# EAGLE design EspLight (EAGLE 7.4.0)
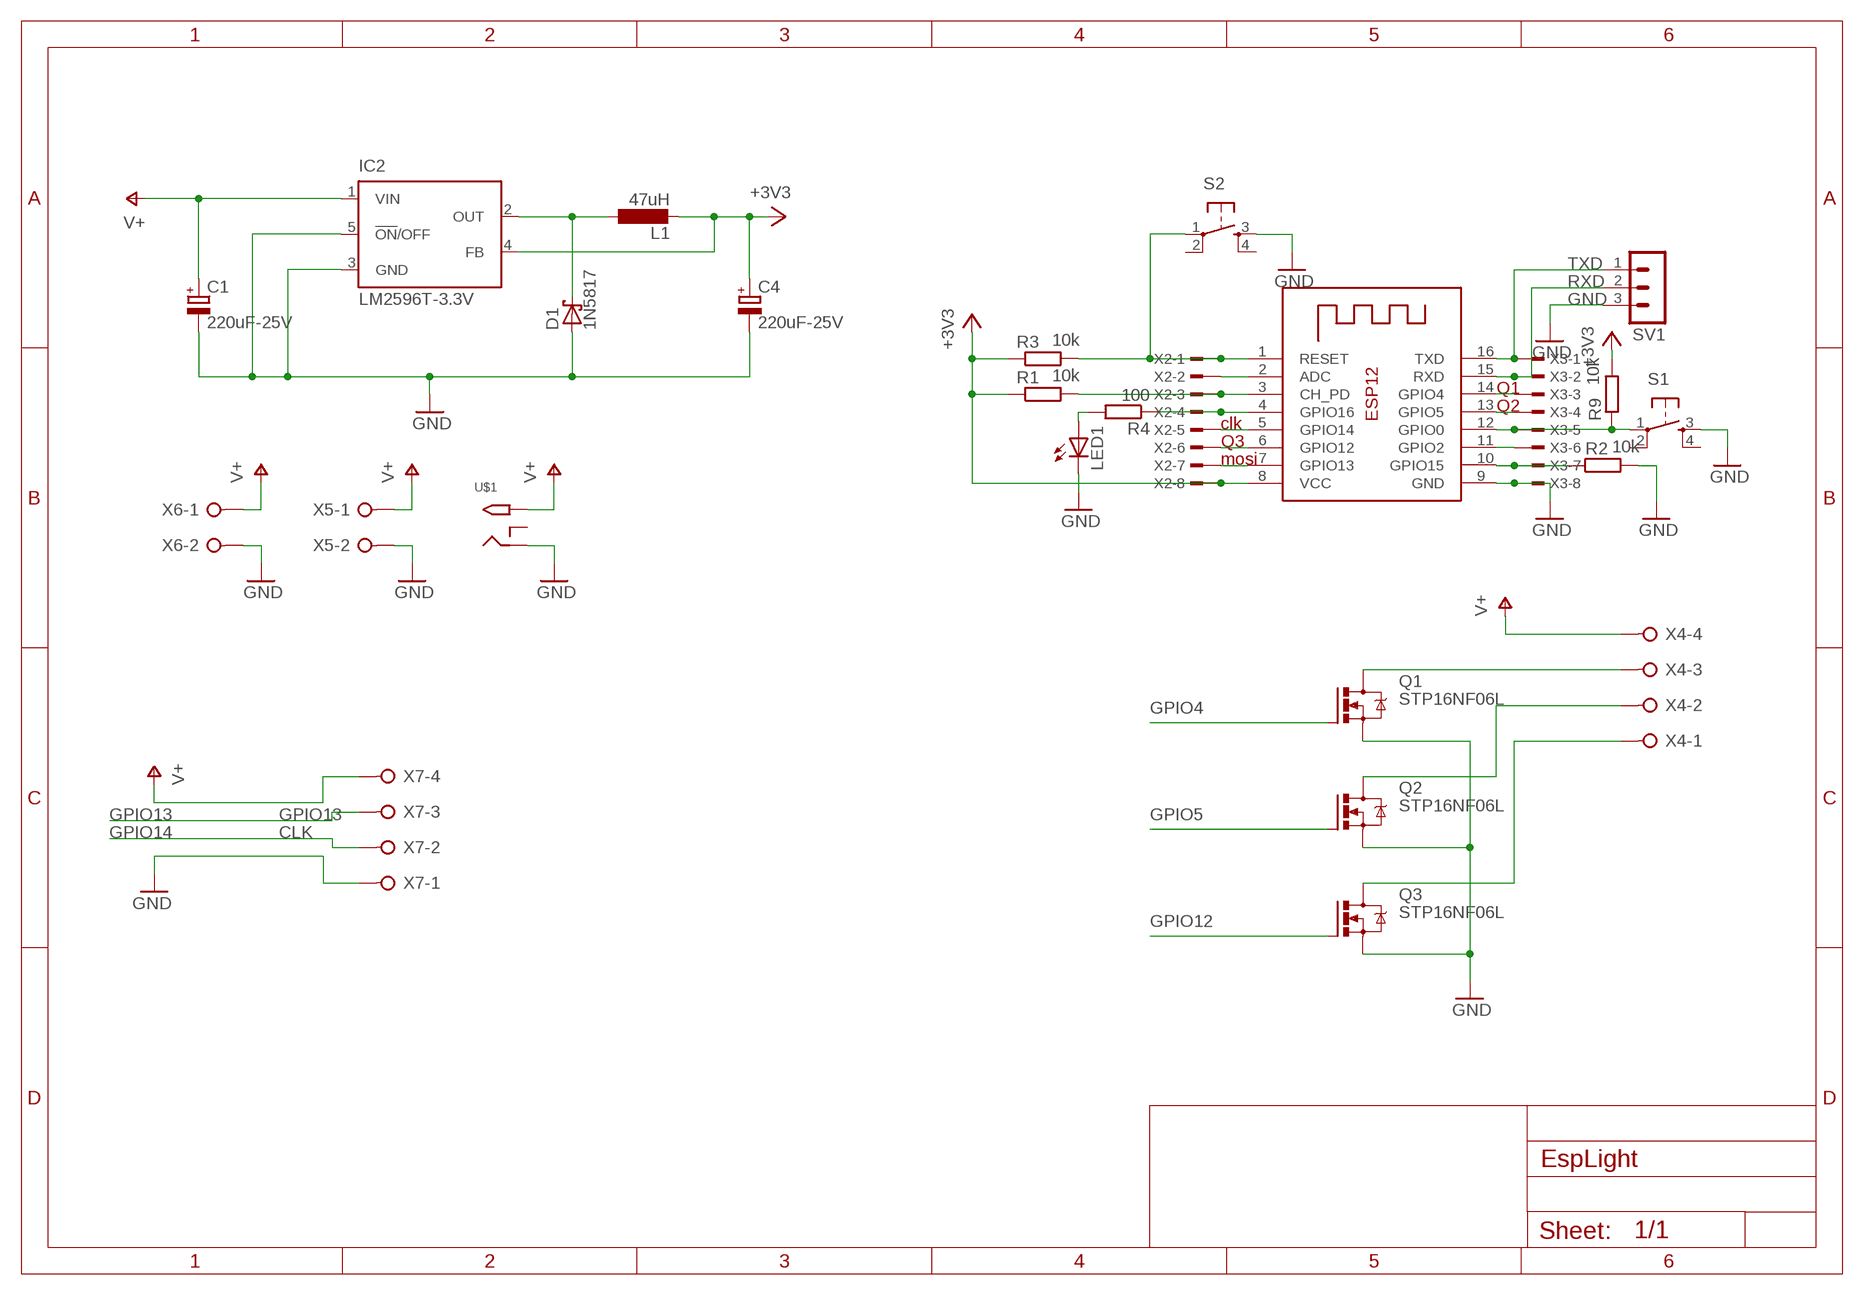
[diagram p0: schematic, sheet 1]

## Parts
C1  220uF-25V  CPOL-EUE2.5-7  [E2,5-7]
C4  220uF-25V  CPOL-EUE2.5-7  [E2,5-7]
D1  1N5817  1N5817-B  [DO41-7.6]
IC2  LM2596T-3.3V  LM2596T  [T05D]
L1  47uH  L-EU6000-XXX-RC  [6000-XXXX-RC]
LED1  LED5MM  [LED5MM]
Q1  STP16NF06L  IRF540  [TO220BV]
Q2  STP16NF06L  IRF540  [TO220BV]
Q3  STP16NF06L  IRF540  [TO220BV]
R1  10k  R-EU_0207/10  [0207/10]
R2  10k  R-EU_0207/10  [0207/10]
R3  10k  R-EU_0207/10  [0207/10]
R4  100  R-EU_0207/10  [0207/10]
R9  10k  R-EU_0207/10  [0207/10]
S1  TAC_SWITCHPTH  [TACTILE-PTH]
S2  TAC_SWITCHPTH  [TACTILE-PTH]
SV1  MA03-1  [MA03-1]
U$1  2.1MMJACKTHM  [PJ-102A]
X1  ESP-12  [ESP-12]
X2  TSW-108-02-S-S  [TSW-108-02-S-S]
X3  TSW-108-02-S-S  [TSW-108-02-S-S]
X4  W237-04P  [W237-4P]
X5  W237-02P  [W237-132]
X6  W237-02P  [W237-132]
X7  W237-04P  [W237-4P]

## Nets
+3V3: C4.+ IC2.4(FB) L1.2 R1.1 R3.1 R9.2 X1.8(VCC) X2.8
GND: C1.- C4.- D1.A IC2.3(GND) IC2.5(!ON!/OFF) LED1.K(C) Q1.S Q2.S Q3.S R2.2 S1.3 S2.3 SV1.3 U$1.RING X1.9(GND) X3.8 X5.2 X6.2 X7.1
GPIO2: X1.11(GPIO2) X3.6
GPIO4: Q1.G X1.14(GPIO4) X3.3
GPIO5: Q2.G X1.13(GPIO5) X3.4
GPIO12: Q3.G X1.6(GPIO12) X2.6
GPIO13: X1.7(GPIO13) X2.7 X7.3
GPIO14: X1.5(GPIO14) X2.5 X7.2
N$2: R3.2 S2.1 X1.1(RESET) X2.1
N$3: R1.2 X1.3(CH_PD) X2.3
N$4: R2.1 X1.10(GPIO15) X3.7
N$6: R4.1 X1.4(GPIO16) X2.4
N$9: R9.1 S1.1 X1.12(GPIO0) X3.5
N$10: X1.2(ADC) X2.2
N$14: LED1.A R4.2
N$15: D1.C IC2.2(OUT) L1.1
N$18: Q1.D X4.3
N$19: Q2.D X4.2
N$20: Q3.D X4.1
RXD: SV1.2 X1.15(RXD) X3.2
TXD: SV1.1 X1.16(TXD) X3.1
V+: C1.+ IC2.1(VIN) U$1.TIP X4.4 X5.1 X6.1 X7.4
Unconnected: S1.2 S1.4 S2.2 S2.4 U$1.RING_SW

## Notes on the sheet
- Q1
- Q2
- clk
- Q3
- mosi
- CLK

## Library data of the parts
C1 C4 = rcl:CPOL-EU: POLARIZED CAPACITOR, European symbol
D1 = diode:1N581*: 1.0A SCHOTTKY BARRIER RECTIFIER Source: http://www.diodes.com/datasheets/ds23001.pdf
IC2 = national-semiconductor:LM2596: SIMPLE SWITCHER® Power Converter 150 kHz 3A Step-Down Voltage Regulator Source: http://www.national.com/ds/LM/LM2596.pdf; MPN: LM2596T-ADJ/LF02; OC_FARNELL: 9494162; OC_NEWARK: 65K5910
L1 = rcl:L-EU: INDUCTOR, European symbol
LED1 = adafruit:LED: LED OSRAM: - CHIPLED LG R971, LG N971, LY N971, LG Q971, LY Q971, LO R971, LY R971 LH N974, LH R974 LS Q976, LO Q976, LY Q976 LO Q996 - Hyper CHIPLED LW Q18S LB Q993, LB Q99A, LB R99A - SideLED LS A670, LO A670, LY A670, LG A670, LP A670 LB A673, LV A673, LT A673, LW A673 LH A674 LY A675 LS A676, LA A676, LO A676, LY A676, LW A676 LS A679, LY A679, LG A679 - Hyper Micro SIDELED® LS Y876, LA Y876, LO Y876, LY Y876 LT Y87S - SmartLED LW L88C, LW L88S LB L89C, LB L89S, LG L890 LS L89K, LO L89K, LY L89K LS L896, LA L896, LO L896, LY L896 - TOPLED LS T670, LO T670, LY T670, LG T670, LP T670 LSG T670, LSP T670, LSY T670, LOP T670, LYG T670 LG T671, LOG T671, LSG T671 LB T673, LV T673, LT T673, LW T673 LH T674 LS T676, LA T676, LO T676, LY T676, LB T676, LH T676, LSB T676, LW T676 LB T67C, LV T67C, LT T67C, LS T67K, LO T67K, LY T67K, LW E67C LS E67B, LA E67B, LO E67B, LY E67B, LB E67C, LV E67C, LT E67C LW T67C LS T679, LY T679, LG T679 LS T770, LO T770, LY T770, LG T770, LP T770 LB T773, LV T773, LT T773, LW T773 LH T774 LS E675, LA E675, LY E675, LS T675 LS T776, LA T776, LO T776, LY T776, LB T776 LHGB T686 LT T68C, LB T68C - Hyper Mini TOPLED® LB M676 - Mini TOPLED Santana® LG M470 LS M47K, LO M47K, LY M47K Source: http://www.osram.convergy.de/
Q1-Q3 = transistor-power:IRF540: HEXFET Power MOSFET
R1-R4 R9 = rcl:R-EU_: RESISTOR, European symbol
S1 S2 = SparkFun-Retired:TAC_SWITCH: Momentary Switch Button commonly used for reset or general input. Spark Fun Electronics SKU : COM-00097 SMT- SWCH-08247
SV1 = con-lstb:MA03-1: PIN HEADER; OC_FARNELL: unknown; OC_NEWARK: unknown
U$1 = adafruit:2.1MMJACK: 2.1mm x 5.5mm THM DC jack with internal switch. Digikey part #PJ-102A, 4UCON part #05537 2.1mm x 5.5mm SMT DC jack with internal switch. Digikey part #PJ-002A-SMT, 4UCON part #03267 By microbuilder.eu & adafruit.com
X1 = adafruit:ESP-12
X2 X3 = con-samtec:TSW-108-02-S-S: THROUGH-HOLE .025" SQ POST HEADER Source: Samtec TSW.pdf; OC_FARNELL: unknown; OC_NEWARK: unknown
X4 X7 = con-wago-508:W237-04P: WAGO SREW CLAMP; OC_FARNELL: unknown; OC_NEWARK: unknown
X5 X6 = con-wago-508:W237-02P: WAGO SREW CLAMP; OC_FARNELL: unknown; OC_NEWARK: unknown

## Board
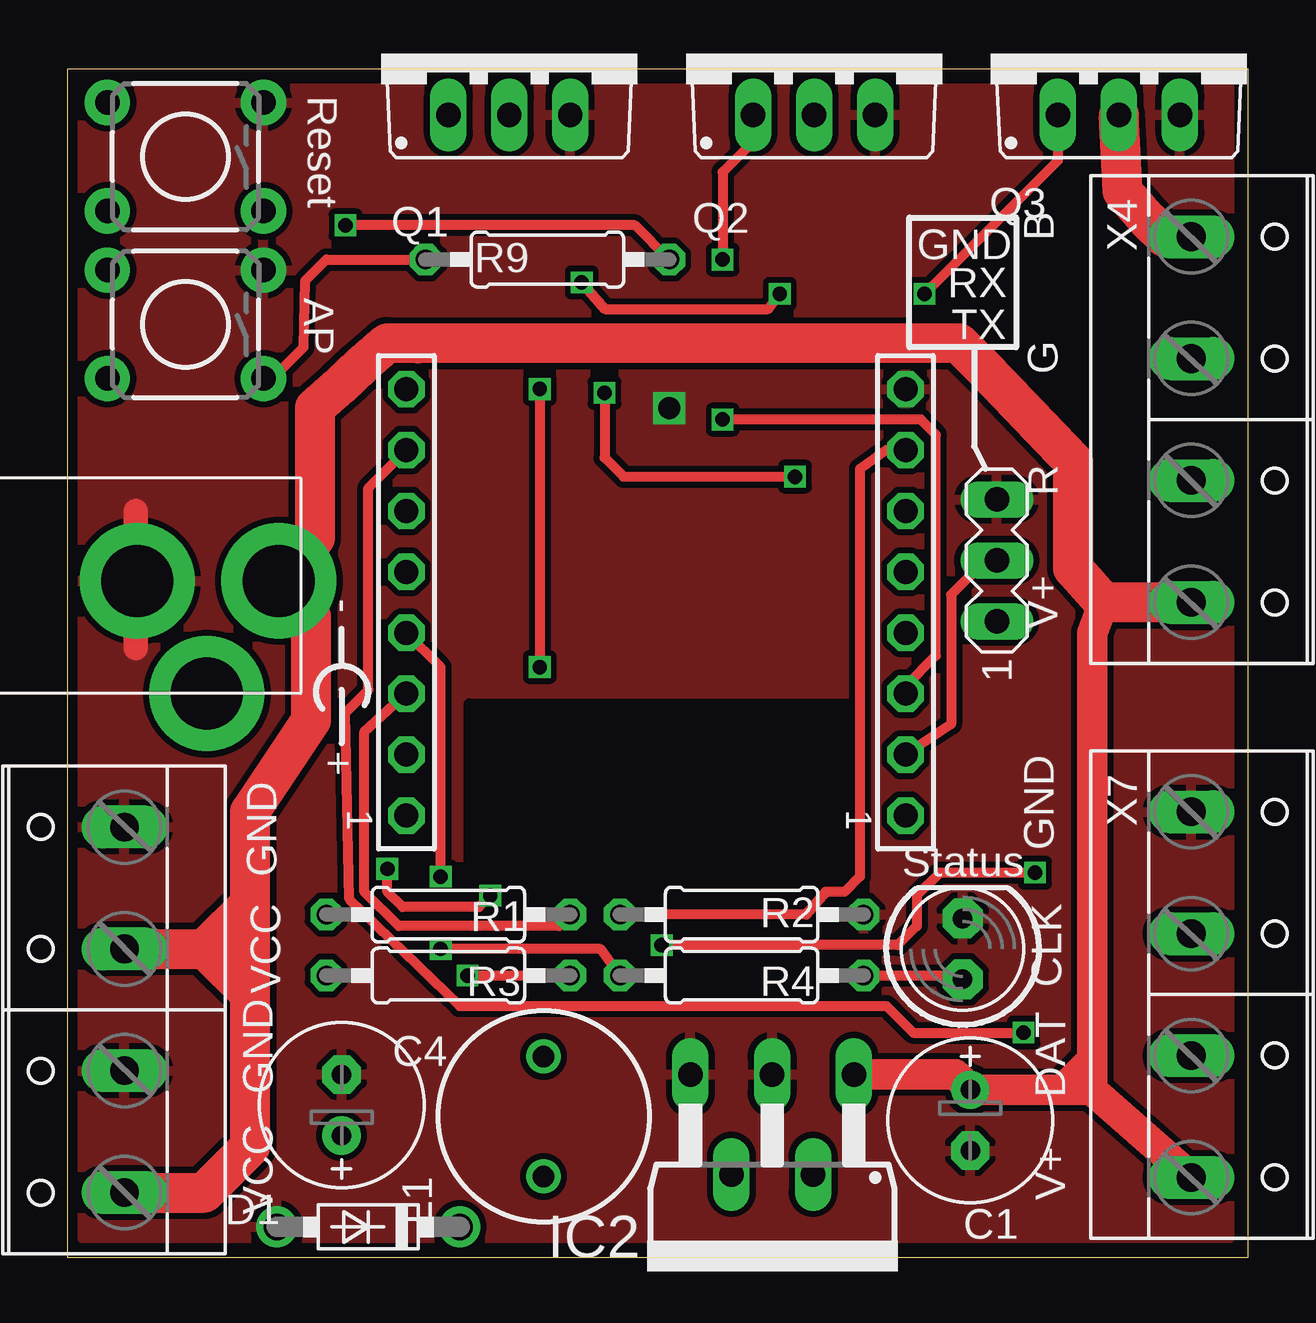
[diagram p1: board, top side]
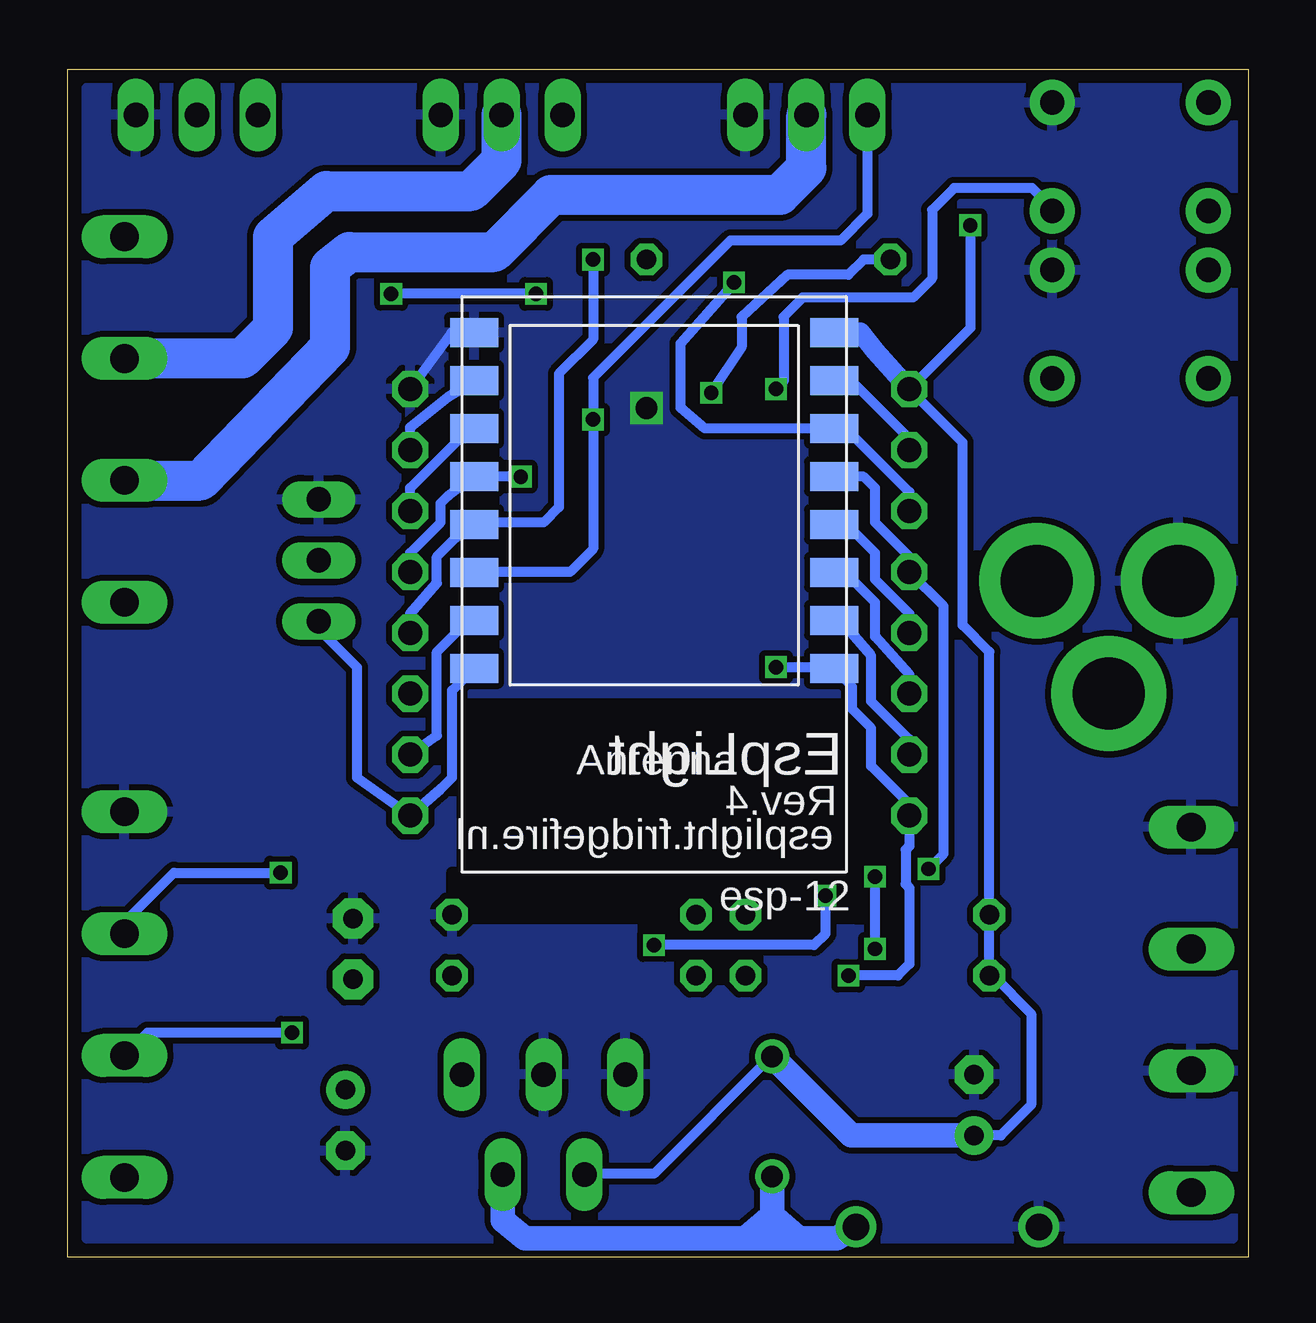
[diagram p2: board, bottom side, seen from below]

Size 49.2 x 49.52 mm. Coordinates in mm from the lower left corner, seen from the top.
Outline: 0,0 49.2,0 49.2,49.52 0,49.52 0,0
Copper layers (1*16): Top 0.035mm / dielectric 1.5mm / Bottom 0.035mm
Design rules "SeeedStudio_2layer_DRU_no_angle_20140221": minimum track width 6mil, minimum drill 12mil, track to track 6mil, track to pad 6mil, pad to pad 6mil, via to via 6mil, smd to smd 0mil, copper to edge 10mil, drill to drill 10mil, minimum pad ring 10mil, minimum via ring 6mil, stop-mask expansion 2mil, vias tented up to drill 100mil, thermal gap 10mil
tRestrict: area 16.4,14.1 to 33.2,16
bRestrict: area 16.4,14.1 to 33.2,16

### Footprints (pad centres in the part's own frame; a part is rotated, then mirrored left to right if it is on the bottom)
E2,5-7 = drill 0.813 pad 1.6: + -1.27,0 | drill 0.813 pad 1.6 octagon: - 1.27,0
DO41-7.6 = drill 1.1 pad 1.7: A 3.81,0; C -3.81,0
T05D = drill 1.016 long: 1 -3.404,-5.08; 2 -1.702,-0.914; 3 0,-5.08; 4 1.702,-0.914; 5 3.404,-5.08
6000-XXXX-RC = drill 0.9 pad 1.422: 1 -2.5,0; 2 2.5,0
LED5MM = drill 0.813 pad 1.676 octagon: A -1.27,0; K 1.27,0
TO220BV = drill 1.016 long: D 0,-2.54; G -2.54,-2.54; S 2.54,-2.54
0207/10 = drill 0.813 octagon: 1 -5.08,0; 2 5.08,0
TACTILE-PTH = drill 1.016 pad 1.88: 1 -3.251,2.261; 2 3.251,2.261; 3 -3.251,-2.261; 4 3.251,-2.261
MA03-1 = drill 1.016 long: 1 -2.54,0; 2 0,0; 3 2.54,0
PJ-102A = drill 3 pad 4.8: RING 0.1,-3.39; RING_SW -4.6,-6.29; TIP 0.1,-9.29
ESP-12 = smd 2 x 1.2: 1 -7.5,4.5; 2 -7.5,2.5; 3 -7.5,0.5; 4 -7.5,-1.5; 5 -7.5,-3.5; 6 -7.5,-5.5; 7 -7.5,-7.5; 8 -7.5,-9.5; 9 7.5,-9.5; 10 7.5,-7.5; 11 7.5,-5.5; 12 7.5,-3.5; 13 7.5,-1.5; 14 7.5,0.5; 15 7.5,2.5; 16 7.5,4.5
TSW-108-02-S-S = drill 1 pad 1.5 octagon: 1 8.89,0; 2 6.35,0; 3 3.81,0; 4 1.27,0; 5 -1.27,0; 6 -3.81,0; 7 -6.35,0; 8 -8.89,0
W237-4P = drill 1.194 long: 1 -7.62,-0.635; 2 -2.54,-0.635; 3 2.54,-0.635; 4 7.62,-0.635
W237-132 = drill 1.194 long: 1 -2.54,-0.635; 2 2.54,-0.635

### Placement (x,y rotation side)
C1  37.62,5.71 270 top
C4  11.43,6.35 90 top
D1  12.54,1.27 180 top
IC2  LM2596T  [T05D]  29.37,2.54 180 top
L1  19.84,5.87 90 top
LED1  37.31,12.86 90 top
Q1  18.41,50.16 0 top
Q2  31.11,50.16 0 top
Q3  43.81,50.16 0 top
R1  15.88,14.29 0 top
R2  28.1,14.29 0 top
R3  15.88,11.75 0 top
R4  28.1,11.75 0 top
R9  20,41.59 0 top
S1  4.92,38.89 180 top
S2  4.92,45.88 180 top
SV1  38.73,29.05 90 top
U$1  -0.48,28.1 90 top
X1  24.77,29.05 180 bottom
X2  14.13,27.3 270 top
X3  34.92,27.3 270 top
X4  47.47,34.92 270 top
X5  1.75,15.4 90 top
X6  1.75,5.24 90 top
X7  47.47,10.95 270 top

### Tracks (layer width: path | path; a pad name or v marks a point on that pad's centre or on a via)
+3V3  (via drill 0.6)
  Top 0.406: R9.2 23.65,43.02 v11.59,43.02
  Bottom 0.406: L1.2 19.88,8.37 24.77,3.49 27.63,3.49 IC2.4 | C4.+ 10.32,5.08 9.05,6.35 9.05,10.16 10.64,11.75 R3.1 R1.1 10.79,25.24 11.91,26.35 11.91,33.97 X2.8 11.59,38.73 v11.59,43.02
  Bottom 0.813: X2.8 15.56,37.78 16.18,38.58 X1.8
  Bottom 1.016: C4.+ 16.55,5.08 L1.2
GND  (via drill 0.9)
  Top 1.016: 2.86,31.11 2.86,25.4
  Bottom 0.406: X1.9 33.2,38.55 X3.8
  other vias: 25.08,35.4
  pour Top (isolate 0.254, rank 6): 0.64,48.74 48.42,48.74 48.42,0.79 0.64,0.79
  pour Bottom (isolate 0.254, rank 6): 0.64,48.74 48.42,48.74 48.42,0.79 0.64,0.79
GPIO2
  Bottom 0.406: X3.6 34.92,32.07 33.02,33.97 32.32,34.61 X1.11
GPIO4  (via drill 0.6)
  Top 0.406: X3.3 34.92,23.81 36.2,25.08 36.2,34.29 35.56,34.92 v27.3,34.92
  Bottom 0.406: 32.86,28.42 32.4,28.42 X1.14 32.24,28.57 28.26,28.57 27.3,29.53 v27.3,34.92 27.3,36.67 21.59,42.39 16.99,42.39 15.88,43.5 Q1.G
GPIO5  (via drill 0.6)
  Top 0.406: Q2.G 28.57,46.51 27.3,45.24 v27.3,41.59
  Bottom 0.406: X3.4 34.92,26.83 33.81,28.1 33.81,29.21 33.02,30 32.35,30.64 X1.13 32.18,30.64 29.37,30.64 28.73,31.27 28.73,36.83 27.3,38.26 v27.3,41.59
GPIO12  (via drill 0.6)
  Top 0.406: Q3.G 41.27,45.72 v35.72,40.16 | v21.43,40.64 22.38,39.53 29.21,39.53 v29.69,40.16
  Bottom 0.406: X2.6 14.13,31.91 16.67,34.45 17.16,34.45 X1.6 22.64,34.55 23.65,35.4 23.65,38.1 v21.43,40.64 | v29.69,40.16 v35.72,40.16 35.88,40.32
GPIO13  (via drill 0.6)
  Top 0.406: X2.7 12.54,32.07 12.54,23.65 11.59,22.7 11.75,14.92 16.35,10.48 34.13,10.48 35.24,9.37 v39.85,9.37
  Bottom 0.406: X2.7 14.13,34.13 16.51,36.51 17.23,36.51 X1.7 | v39.85,9.37 45.88,9.37 X7.3
GPIO14  (via drill 0.6)
  Top 0.406: v17.62,15.08 17.14,14.61 13.97,14.61 13.34,15.24 v13.34,16.19 | v40.32,16.03 36.35,16.03 35.4,15.08 35.4,13.81 34.61,13.02 v24.77,13.02
  Bottom 0.406: X1.5 17.26,32.54 16.03,32.54 15.56,32.07 15.56,30.64 14.13,29.21 X2.5 12.7,27.15 12.7,16.83 v13.34,16.19 | v17.62,15.08 17.62,13.49 18.1,13.02 v24.77,13.02 | X7.2 46.83,13.97 44.77,16.03 v40.32,16.03
N$2  (via drill 0.6)
  Top 0.406: v16.67,11.75 R3.2 | v19.68,36.2 v19.68,24.61
  Bottom 0.406: v16.67,11.75 14.61,11.75 14.13,12.22 14.13,15.4 14.29,15.56 14.29,16.99 14.13,17.14 X2.1 14.13,18.89 15.72,20.48 15.72,22.07 16.51,22.86 16.51,23.8 X1.1 17.32,24.61 v19.68,24.61 | S2.1 8.57,44.13 9.01,44.57 12.26,44.57 13.18,43.66 13.18,40.8 13.97,40.01 18.57,40.01 19.37,39.21 19.37,36.51 v19.68,36.2
N$3
  Top 0.406: R1.2 20.48,13.81 13.81,13.81 12.38,15.24 12.38,21.91 X2.3
  Bottom 0.406: X2.3 14.13,24.29 15.56,25.88 15.56,27.3 16.67,28.42 17.13,28.42 X1.3
N$4
  Top 0.406: X3.7 34.13,33.66 33.02,32.86 33.02,15.88 32.38,15.24 31.59,15.24 30.8,14.29 R2.1
  Bottom 0.406: X3.7 34.92,34.61 33.34,35.88 32.3,36.51 X1.10
N$6  (via drill 0.6)
  Top 0.406: R4.1 22.23,12.86 v15.56,12.86 | v15.56,15.88 15.56,24.61 X2.4
  Bottom 0.406: X2.4 14.13,26.83 15.56,28.26 15.56,29.37 16.67,30.48 17.19,30.48 X1.4 | v15.56,12.86 v15.56,15.88
N$9  (via drill 0.6)
  Top 0.406: S1.1 8.53,36.63 9.84,37.94 9.92,40.72 10.79,41.59 R9.1 | v22.38,36.04 22.38,33.34 23.18,32.54 v30.32,32.54
  Bottom 0.406: X3.5 34.92,29.37 33.66,30.64 33.66,31.43 33.34,31.75 X1.12 32.26,32.54 v30.32,32.54 | R9.1 16.03,41.59 16.67,40.96 19.21,40.96 21.11,39.21 21.11,37.94 v22.38,36.04
N$10
  Bottom 0.406: X2.2 14.13,21.59 15.72,23.18 15.72,25.08 16.83,26.35 17.07,26.35 X1.2
N$14
  Top 0.406: R4.2 36.99,11.75 LED1.A
N$15
  Bottom 1.016: IC2.2 31.07,1.54 30.16,0.79 20.95,0.79 | 20.95,0.79 19.84,0.79 | 19.84,0.79 18.73,0.79 | 18.73,0.79 17.14,0.79 D1.C | L1.1 19.84,1.75 | 19.84,1.75 19.84,0.79 | 19.84,1.75 20.95,0.79 | 19.84,1.75 18.73,0.79
N$18
  Bottom 1.676: X4.3 43.66,32.38 38.26,37.94 38.26,41.27 37.47,41.91 31.43,41.91 29.05,44.29 19.53,44.29 18.41,45.4 Q1.D
N$19
  Bottom 1.676: Q2.D 31.11,45.72 32.38,44.45 38.42,44.45 40.64,42.55 40.64,38.73 41.91,37.47 X4.2
N$20
  Top 1.676: X4.1 45.72,42.55 45.09,43.18 43.97,44.45 Q3.D
RXD
  Top 0.406: SV1.2 38.26,29.05 36.83,27.62 36.83,22.23 X3.2
  Bottom 0.406: X3.2 33.81,21.75 33.81,25.24 32.86,26.19 32.62,26.19 X1.15
TXD
  Bottom 0.406: X1.16 33.18,23.64 33.18,20 33.66,19.53 X3.1 37.15,20 37.15,24.61 38.73,26.19 SV1.1
V+
  Top 0.406: 11.54,36.83 11.38,36.34
  Top 0.61: 14.45,38.41 14.6,38.09
  Top 1.27: 43.18,27.3 42.7,26.04 42.7,8.26 | 42.7,8.26 42.7,6.99 | 42.7,6.99 42.86,6.83 X7.4 | IC2.1 36.99,7.62 C1.+ 41.43,6.99 | 41.43,6.99 42.7,6.99 | 42.7,8.26 41.43,6.99
  Top 1.676: X6.1 5.71,2.7 7.62,4.6 7.62,10.95 | 7.62,10.95 7.62,12.86 | 7.62,12.86 7.62,14.76 | 7.62,14.76 7.62,18.57 10.16,22.38 10.16,26.69 U$1.TIP 8.73,28.12 10.32,30 10.32,35.4 11.38,36.34 12.22,37.15 13.34,38.1 14.6,38.09 37.15,38.1 38.26,36.99 41.91,33.18 41.91,28.73 43.18,27.3 X4.4 | X5.1 5.71,12.86 | 5.71,12.86 7.62,12.86 | 7.62,14.76 5.71,12.86 | 5.71,12.86 7.62,10.95

### Text on the board
tNames: Reset | GND | B | AP | RX | TX | G | R | - | V+ | + | GND | GND | Status | VCC | CLK | GND | DAT | VCC | V+
bNames: EspLight | Rev.4 | esplight.fridgefire.nl | esp-12